# EAGLE design ATtiny841_Basic5 (EAGLE 9.1.1)
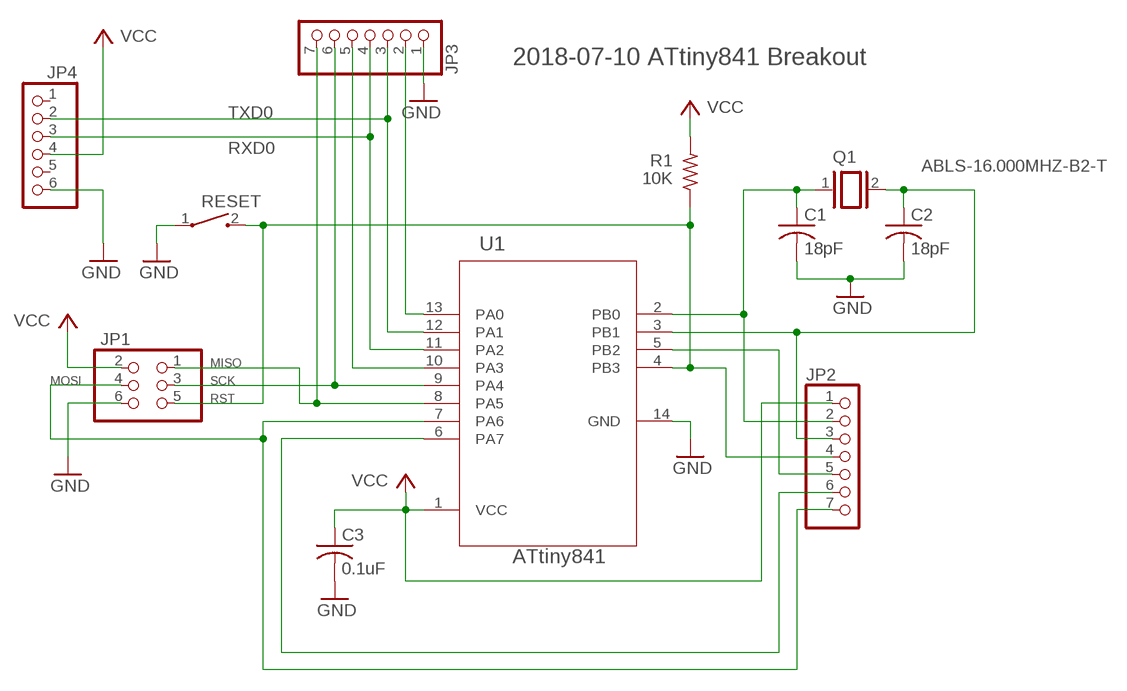
[diagram p0: schematic, sheet 1]

## Parts
C1  18pF  C-USC0805  [C0805]
C2  18pF  C-USC0805  [C0805]
C3  0.1uF  C-USC0805  [C0805]
JP1  PINHD-2X3  [2X03]
JP2  PINHD-1X7  [1X07]
JP3  PINHD-1X7  [1X07]
JP4  PINHD-1X6/90  [1X06/90]
Q1  ABLS-16.000MHZ-B2-T  XTAL/SXTAL-SMD  [XTAL1140X470X420]
R1  10K  R-US_R0805  [R0805]
RESET  SPST-THROUGHHOLE  [SPST-THROUGHHOLE]
U1  ATtiny841  ATTINY841-SSUATTINY841-SO14  [SOIC127P599X175-14]

## Nets
GND: C1.2 C2.2 C3.2 JP1.6 JP3.1 JP4.6 RESET.1 U1.14(GND)
MISO: JP1.1 JP3.7 U1.8(PA5)
MOSI: JP1.4 JP2.7 U1.7(PA6)
PA0: JP3.2 U1.13(PA0)
PA3: JP3.5 U1.10(PA3)
PA7: JP2.6 U1.6(PA7)
PB0: C1.1 JP2.2 Q1.1 U1.2(PB0)
PB1: C2.1 JP2.3 Q1.2 U1.3(PB1)
PB2: JP2.5 U1.5(PB2)
RST: JP1.5 JP2.4 R1.1 RESET.2 U1.4(PB3)
RXD0: JP3.4 JP4.3 U1.11(PA2)
SCK: JP1.3 JP3.6 U1.9(PA4)
TXD0: JP3.3 JP4.2 U1.12(PA1)
VCC: C3.1 JP1.2 JP2.1 JP4.4 R1.2 U1.1(VCC)
Unconnected: JP4.1 JP4.5

## Notes on the sheet
- 2018-07-10 ATtiny841 Breakout

## Library data of the parts
C1-C3 = AUmlib:C-US: CAPACITOR, American symbol; SPICEPREFIX: C
JP1 = AUmlib:PINHD-2X3: PIN HEADER
JP2 JP3 = AUmlib:PINHD-1X7: PIN HEADER
JP4 = AUmlib:PINHD-1X6: PIN HEADER
Q1 = AUmlib:XTAL/S: CRYSTAL
R1 = AUmlib:R-US_: RESISTOR, American symbol; SPICEPREFIX: R
RESET = AUmlib:SPST-THROUGHHOLE: SPST Through hole tactile switch Digikey EG2510-ND $0.35 ea (2018-07-09) E-Switch part TL1107AF130WQ
U1 = AUmlib:ATTINY841-SSU

## Board
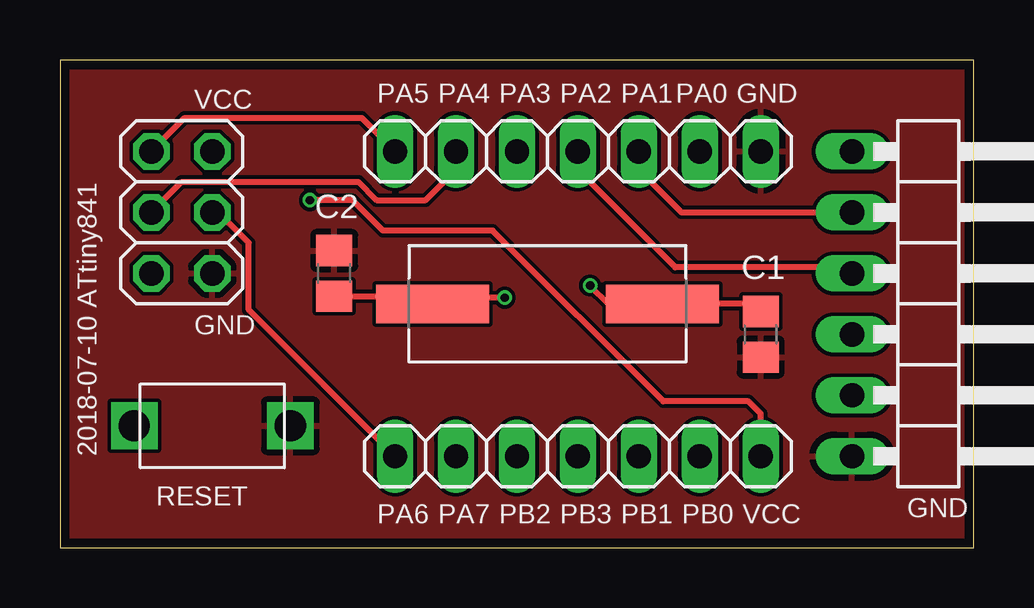
[diagram p1: board, top side]
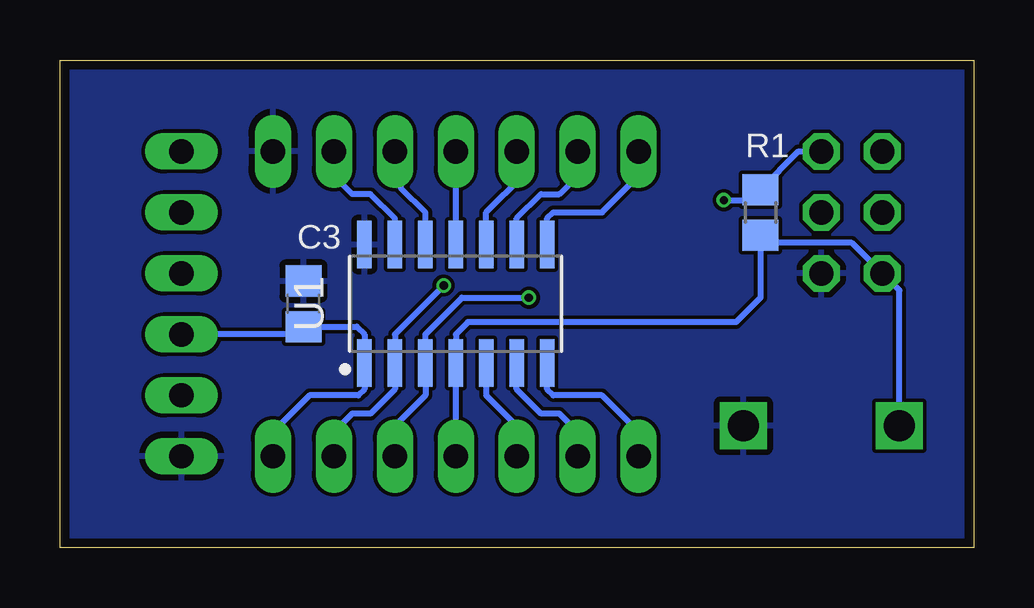
[diagram p2: board, bottom side, seen from below]

Size 38.09 x 20.32 mm. Coordinates in mm from the lower left corner, seen from the top.
Outline: 0,20.32 0,0 38.09,0 38.09,20.32 0,20.32
Copper layers (1*16): Top 0.035559375mm / dielectric 1.6mm / Bottom 0.035559375mm
Design rules "oshpark-2layer": minimum track width 6mil, minimum drill 10mil, track to track 6mil, track to pad 6mil, pad to pad 6mil, via to via 6mil, smd to smd 6mil, copper to edge 15mil, drill to drill 6mil, minimum pad ring 5mil, minimum via ring 5mil, stop-mask expansion 2.5mil, vias tented up to drill 0mil, thermal gap 10mil

### Footprints (pad centres in the part's own frame; a part is rotated, then mirrored left to right if it is on the bottom)
C0805 = smd 1.3 x 1.5: 1 -0.95,0; 2 0.95,0
2X03 = drill 1.016 octagon: 1 -2.54,-1.27; 2 -2.54,1.27; 3 0,-1.27; 4 0,1.27; 5 2.54,-1.27; 6 2.54,1.27
1X07 = drill 1.016 long: 1 -7.62,0; 2 -5.08,0; 3 -2.54,0; 4 0,0; 5 2.54,0; 6 5.08,0; 7 7.62,0
1X06/90 = drill 1.016 long: 1 -6.35,-3.81; 2 -3.81,-3.81; 3 -1.27,-3.81; 4 1.27,-3.81; 5 3.81,-3.81; 6 6.35,-3.81
XTAL1140X470X420 = smd 4.72 x 1.611: 1 -4.793,0; 2 4.793,0
R0805 = smd 1.3 x 1.5: 1 -0.95,0; 2 0.95,0
SPST-THROUGHHOLE = drill 1.3 square: 1 -3.25,0; 2 3.25,0
SOIC127P599X175-14 = smd 1.967 x 0.594: 1 -2.469,3.81; 2 -2.469,2.54; 3 -2.469,1.27; 4 -2.469,0; 5 -2.469,-1.27; 6 -2.469,-2.54; 7 -2.469,-3.81; 8 2.469,-3.81; 9 2.469,-2.54; 10 2.469,-1.27; 11 2.469,0; 12 2.469,1.27; 13 2.469,2.54; 14 2.469,3.81

### Placement (x,y rotation side)
C1  29.21,8.89 270 top
C2  11.43,11.43 90 top
C3  27.94,10.16 90 bottom
JP1  5.08,13.97 270 top
JP2  21.59,3.81 180 top
JP3  21.59,16.51 180 top
JP4  36.83,10.16 270 top
Q1  20.32,10.16 180 top
R1  8.89,13.97 90 bottom
RESET  6.35,5.08 180 top
U1  21.59,10.16 90 bottom

### Tracks (layer width: path | path; a pad name or v marks a point on that pad's centre or on a via)
GND
  pour Top: 0,0 0,20.32 38.1,20.32 38.1,0
  pour Bottom: 0,0 0,20.32 38.1,20.32 38.1,0
MISO
  Top 0.254: JP1.1 5.21,17.91 12.57,17.91 JP3.7
  Bottom 0.254: U1.8 17.78,13.72 17.53,13.97 15.49,13.97 13.97,15.49 JP3.7
MOSI
  Top 0.254: JP2.7 7.87,9.91 7.87,12.7 6.6,13.97 JP1.4
  Bottom 0.254: U1.7 17.78,6.6 17.53,6.35 15.49,6.35 13.97,4.83 JP2.7
PA0
  Bottom 0.254: U1.13 24.13,13.72 25.15,14.73 25.91,14.73 26.67,15.49 JP3.2
PA3
  Bottom 0.254: U1.10 20.32,13.97 18.8,15.49 18.8,16.26 JP3.5
PA7
  Bottom 0.254: U1.6 19.05,6.6 18.03,5.59 17.27,5.59 16.76,5.08 16.76,4.06 JP2.6
PB0  (via drill 0.35)
  Top 0.254: C1.1 28.89,10.16 Q1.1 22.86,10.16 v22.1,10.92
  Bottom 0.254: JP2.2 26.42,4.06 26.42,5.08 25.91,5.59 25.15,5.59 24.13,6.6 U1.2 24.13,8.89 v22.1,10.92
PB1  (via drill 0.35)
  Top 0.254: v18.54,10.41 15.78,10.41 Q1.2 15.21,10.48 C2.1
  Bottom 0.254: JP2.3 24.13,5.08 22.86,6.35 U1.3 22.86,8.89 21.34,10.41 v18.54,10.41
PB2
  Bottom 0.254: JP2.5 19.05,5.08 20.32,6.35 U1.5
RST
  Bottom 0.254: RESET.2 3.1,10.72 JP1.5 5.08,12.7 8.57,12.7 R1.1 8.89,10.41 9.91,9.4 21.08,9.4 21.59,8.89 U1.4 JP2.4
RXD0
  Top 0.254: JP3.4 21.59,15.75 25.65,11.68 32.77,11.68 JP4.3
  Bottom 0.254: U1.11 JP3.4
SCK
  Top 0.254: JP1.3 5.08,15.24 12.45,15.24 13.21,14.48 15.24,14.48 16.51,15.75 JP3.6
  Bottom 0.254: U1.9 19.05,13.72 18.03,14.73 17.27,14.73 16.51,15.49 JP3.6
TXD0
  Top 0.254: JP3.3 24.13,15.75 25.91,13.97 JP4.2
  Bottom 0.254: U1.12 22.86,13.97 23.88,14.99 23.88,16.26 JP3.3
VCC  (via drill 0.35)
  Top 0.254: JP2.1 29.21,5.59 28.7,6.1 25.15,6.1 18.03,13.21 13.46,13.21 12.19,14.48 v10.41,14.48
  Bottom 0.254: JP2.1 29.21,4.83 27.69,6.35 25.65,6.35 25.4,6.6 U1.1 25.4,8.89 25.72,9.21 C3.1 28.26,8.89 JP4.4 | JP1.2 7.3,16.51 R1.2 9.33,14.48 v10.41,14.48

### Text on the board
tPlace: PA5 | PA4 | PA3 | PA2 | PA1 | PA0 | GND | VCC | GND | 2018-07-10 ATtiny841 | PA6 | PA7 | PB2 | PB3 | PB1 | PB0 | VCC | GND